# Altium schematic sheet ProbadorDeCables_Accesorios_B_SZCNT_8.SchDoc
size A4
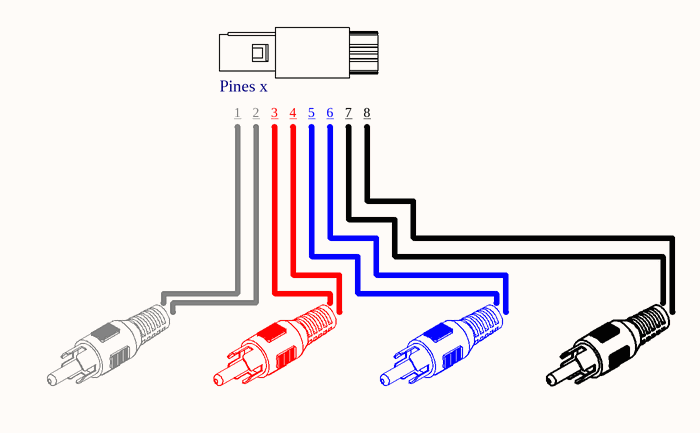
[diagram p0: ProbadorDeCables_Accesorios_B_SZCNT_8.SchDoc]

## Parts
B_SZCNT8  Pines: Pines x  [BOM_SZCNT_Macho]  (hidden comment: SZCNT_0x_Macho)  (mechanical)
BOM_B_SZCNT8__1  RCP-023__Blanco  [BOM_RCP-023__Blanco]  (value not drawn)  (mechanical)
BOM_B_SZCNT8__2  RCP-022__Rojo  [BOM_RCP-022__Rojo]  (value not drawn)  (mechanical)
BOM_B_SZCNT8__3  RCP-025__Azul  [BOM_RCP-025__Azul]  (value not drawn)  (mechanical)
BOM_B_SZCNT8__4  RCP-021__Negro  [BOM_RCP-021__Negro]  (value not drawn)  (mechanical)

## Notes on the sheet
- 1
- (near B_SZCNT8) 2
- (near B_SZCNT8) 3
- (near B_SZCNT8) 4
- (near B_SZCNT8) 5
- (near B_SZCNT8) 6
- 7
- 8

## Library data of the parts
B_SZCNT8 = SZCNT_0x_Macho: Conector SZCNT x vías macho para cable; Cod.DigiKey: Se compra a SZCNT; Cod.Fabricante: *; ComponentLink1Description: Manufacturer Link; ComponentLink1URL: *; DIGIKEYx100: *; Fabricante: SZCNT; DIGIKEYx50: *
BOM_B_SZCNT8__1 = RCP-023__Blanco: CONN RCA PLUG MONO 2COND; Fabricante: CUI Devices; Cod.DigiKey: CP-1455-ND; Cod.Fabricante: RCP-023; ComponentLink1Description: Manufacturer Link; ComponentLink1URL: https://www.cuidevices.com/product/resource/digikeypdf/rcp-02x.pdf; DIGIKEYx50: 1.09940; DIGIKEYx100: 1.05160
BOM_B_SZCNT8__2 = RCP-022__Rojo: CONN RCA PLUG MONO 2COND; Fabricante: CUI Devices; Cod.DigiKey: CP-1454-ND; Cod.Fabricante: RCP-022; ComponentLink1Description: Manufacturer Link; ComponentLink1URL: https://www.cuidevices.com/product/resource/digikeypdf/rcp-02x.pdf; DIGIKEYx50: 1.09940; DIGIKEYx100: 1.05160
BOM_B_SZCNT8__3 = RCP-025__Azul: CONN RCA PLUG MONO 2COND; Fabricante: CUI Devices; Cod.DigiKey: CP-1457-ND; Cod.Fabricante: RCP-025; ComponentLink1Description: Manufacturer Link; ComponentLink1URL: https://www.cuidevices.com/product/resource/digikeypdf/rcp-02x.pdf; DIGIKEYx50: 1.09940; DIGIKEYx100: 1.05160
BOM_B_SZCNT8__4 = RCP-021__Negro: CONN RCA PLUG MONO 2COND; Fabricante: CUI Devices; Cod.DigiKey: CP-1453-ND; Cod.Fabricante: RCP-021; ComponentLink1Description: Manufacturer Link; ComponentLink1URL: https://www.cuidevices.com/product/resource/digikeypdf/rcp-02x.pdf; DIGIKEYx50: 1.09940; DIGIKEYx100: 1.05160